# EAGLE design PCB-BI16-3x5+1 (EAGLE 6.5.0)

## Sheet 1 of 2
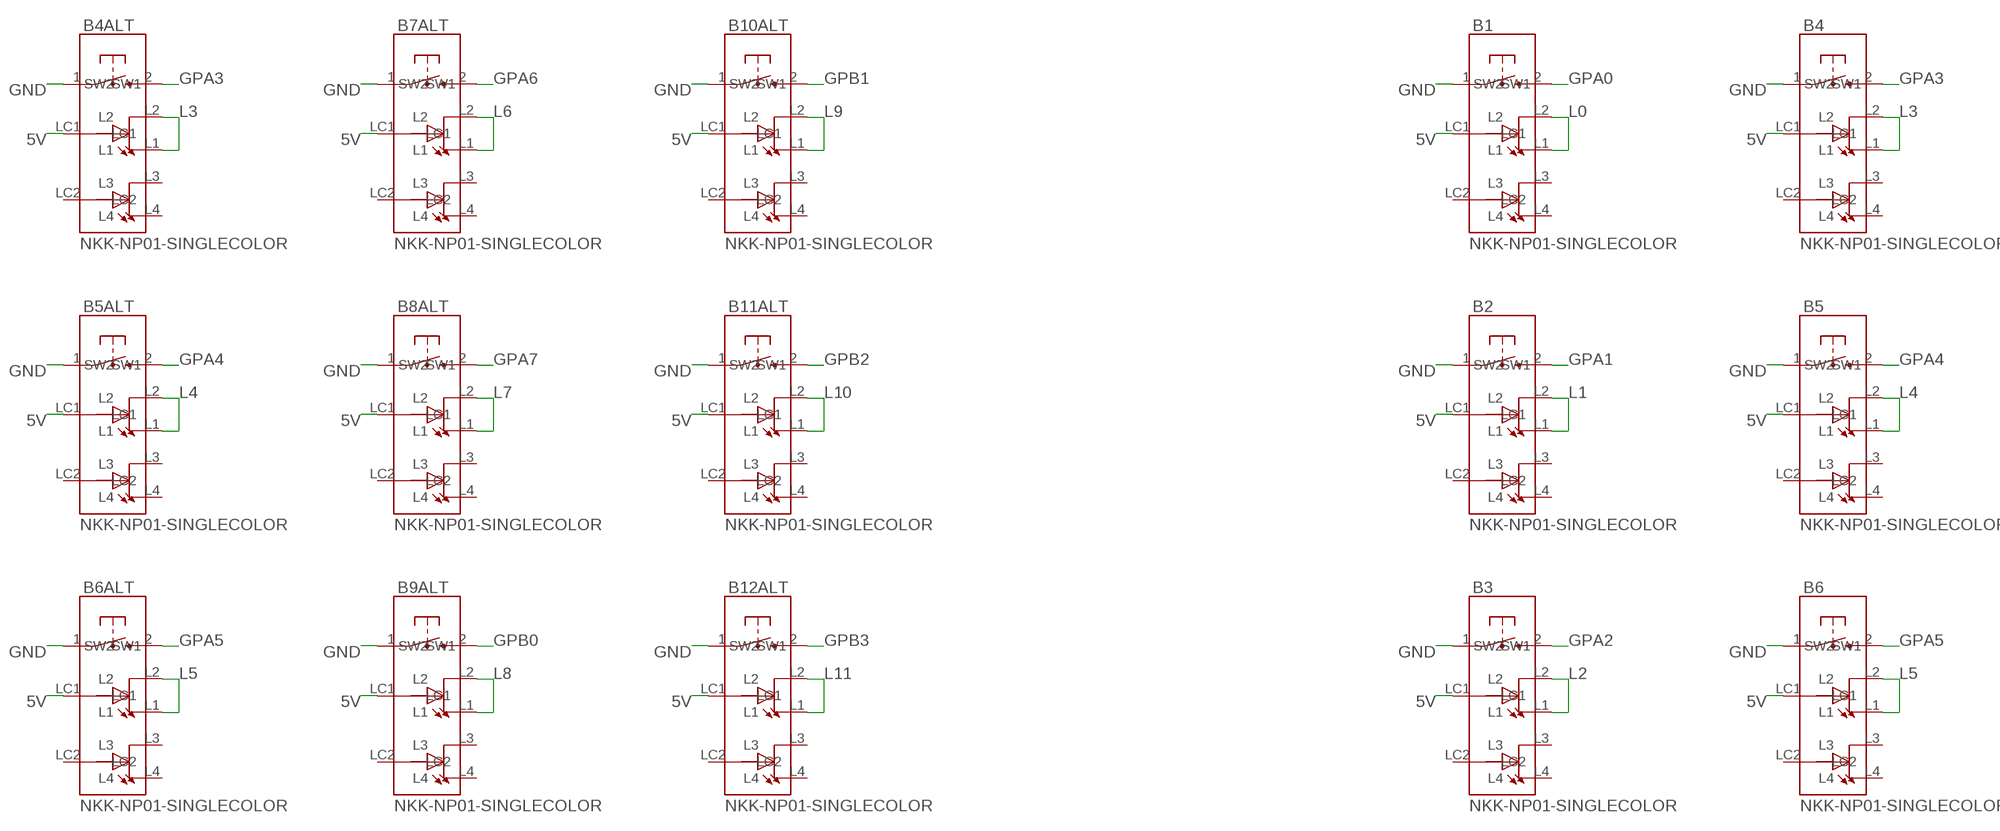
[diagram p0: schematic, sheet 1, part 1 of 2]
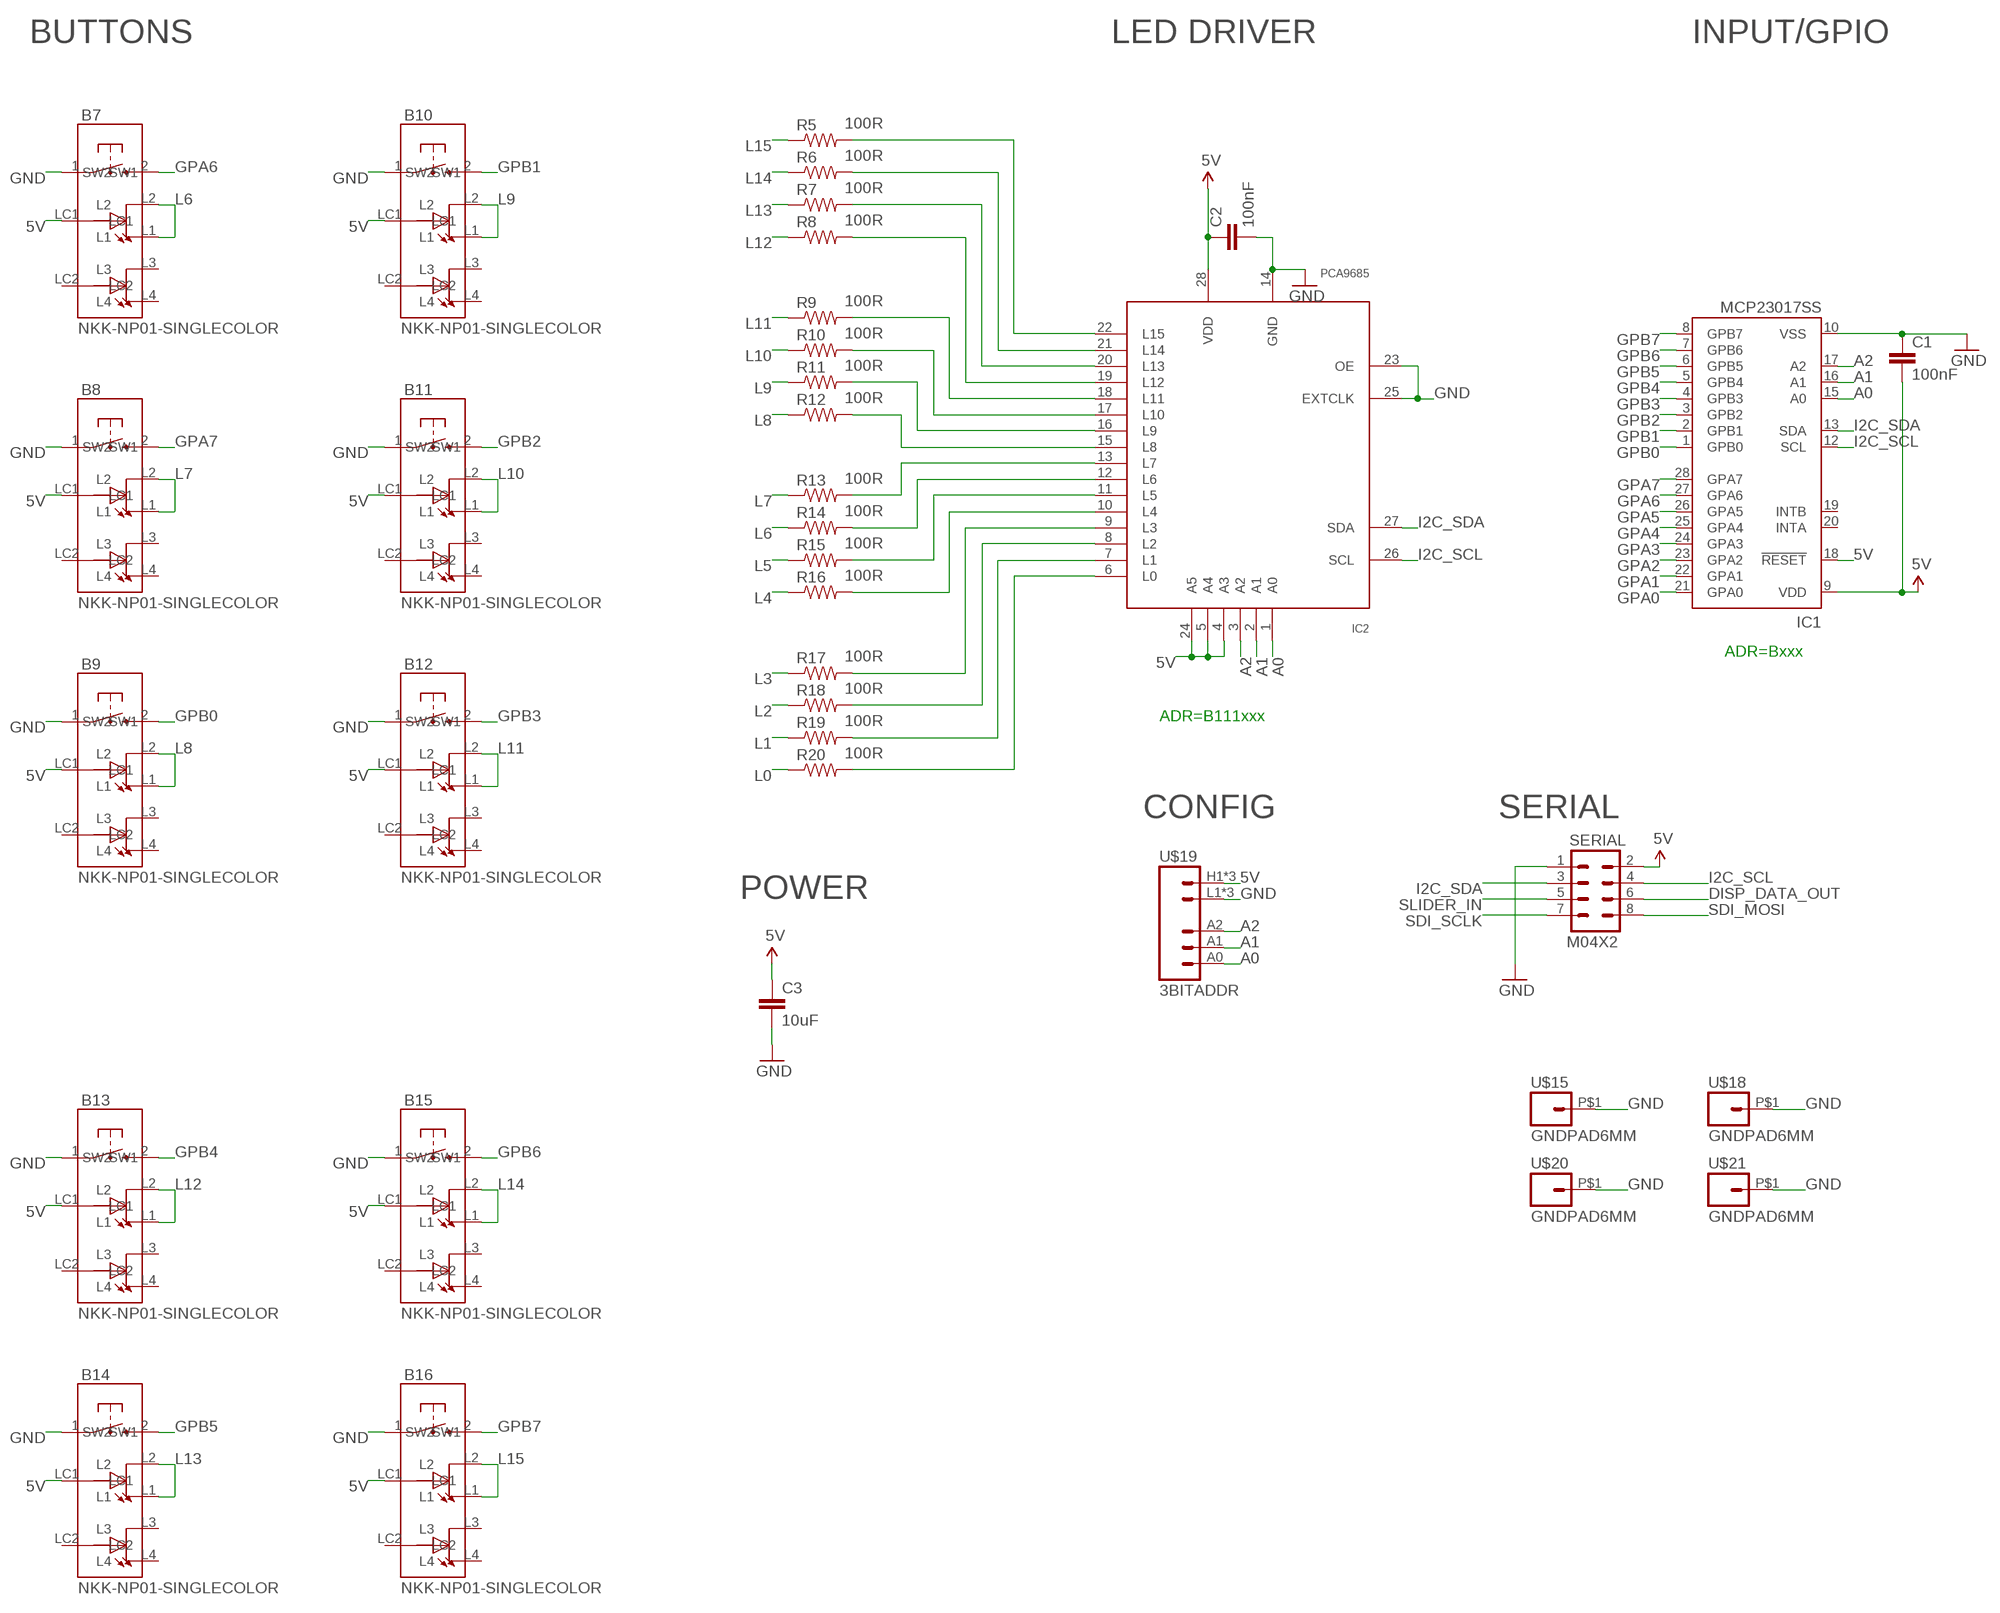
[diagram p1: schematic, sheet 1, part 2 of 2]

### Parts
B1  NKK-NP01-SINGLECOLOR  [NKK-NP01]
B2  NKK-NP01-SINGLECOLOR  [NKK-NP01]
B3  NKK-NP01-SINGLECOLOR  [NKK-NP01]
B4  NKK-NP01-SINGLECOLOR  [NKK-NP01]
B4ALT  NKK-NP01-SINGLECOLOR  [NKK-NP01]
B5  NKK-NP01-SINGLECOLOR  [NKK-NP01]
B5ALT  NKK-NP01-SINGLECOLOR  [NKK-NP01]
B6  NKK-NP01-SINGLECOLOR  [NKK-NP01]
B6ALT  NKK-NP01-SINGLECOLOR  [NKK-NP01]
B7  NKK-NP01-SINGLECOLOR  [NKK-NP01]
B7ALT  NKK-NP01-SINGLECOLOR  [NKK-NP01]
B8  NKK-NP01-SINGLECOLOR  [NKK-NP01]
B8ALT  NKK-NP01-SINGLECOLOR  [NKK-NP01]
B9  NKK-NP01-SINGLECOLOR  [NKK-NP01]
B9ALT  NKK-NP01-SINGLECOLOR  [NKK-NP01]
B10  NKK-NP01-SINGLECOLOR  [NKK-NP01]
B10ALT  NKK-NP01-SINGLECOLOR  [NKK-NP01]
B11  NKK-NP01-SINGLECOLOR  [NKK-NP01]
B11ALT  NKK-NP01-SINGLECOLOR  [NKK-NP01]
B12  NKK-NP01-SINGLECOLOR  [NKK-NP01]
B12ALT  NKK-NP01-SINGLECOLOR  [NKK-NP01]
B13  NKK-NP01-SINGLECOLOR  [NKK-NP01]
B14  NKK-NP01-SINGLECOLOR  [NKK-NP01]
B15  NKK-NP01-SINGLECOLOR  [NKK-NP01]
B16  NKK-NP01-SINGLECOLOR  [NKK-NP01]
C1  100nF  CAP0603-CAP  [0603-CAP]
C2  100nF  CAP0603-CAP  [0603-CAP]
C3  10uF  CAP0805  [0805]
IC1  MCP23017SS  [SSOP28]
IC2  PCA9685  [TSSOP28]
R5  100R  RESISTOR0603-RES  [0603-RES]
R6  100R  RESISTOR0603-RES  [0603-RES]
R7  100R  RESISTOR0603-RES  [0603-RES]
R8  100R  RESISTOR0603-RES  [0603-RES]
R9  100R  RESISTOR0603-RES  [0603-RES]
R10  100R  RESISTOR0603-RES  [0603-RES]
R11  100R  RESISTOR0603-RES  [0603-RES]
R12  100R  RESISTOR0603-RES  [0603-RES]
R13  100R  RESISTOR0603-RES  [0603-RES]
R14  100R  RESISTOR0603-RES  [0603-RES]
R15  100R  RESISTOR0603-RES  [0603-RES]
R16  100R  RESISTOR0603-RES  [0603-RES]
R17  100R  RESISTOR0603-RES  [0603-RES]
R18  100R  RESISTOR0603-RES  [0603-RES]
R19  100R  RESISTOR0603-RES  [0603-RES]
R20  100R  RESISTOR0603-RES  [0603-RES]
SERIAL  M04X2  [2X4]
U$15  GNDPAD6MM  [3.2MMPAD6MM]
U$18  GNDPAD6MM  [3.2MMPAD6MM]
U$19  3BITADDR  [3BITADDR]
U$20  GNDPAD6MM  [3.2MMPAD6MM]
U$21  GNDPAD6MM  [3.2MMPAD6MM]

### Nets
5V [Power]: B1.LC1 B2.LC1 B3.LC1 B4.LC1 B4ALT.LC1 B5.LC1 B5ALT.LC1 B6.LC1 B6ALT.LC1 B7.LC1 B7ALT.LC1 B8.LC1 B8ALT.LC1 B9.LC1 B9ALT.LC1 B10.LC1 B10ALT.LC1 B11.LC1 B11ALT.LC1 B12.LC1 B12ALT.LC1 B13.LC1 B14.LC1 B15.LC1 B16.LC1 C1.2 C2.1 C3.1 IC1.9(VDD) IC1.18(!RESET) IC2.4(A3) IC2.5(A4) IC2.24(A5) IC2.28(VDD) SERIAL.2 U$19.H1(VCC) U$19.H2(VCC) U$19.H3(VCC)
A0: IC1.15(A0) IC2.1(A0) U$19.A0
A1: IC1.16(A1) IC2.2(A1) U$19.A1
A2: IC1.17(A2) IC2.3(A2) U$19.A2
DISP_DATA_OUT: SERIAL.6
GND [Power]: B1.1(SW1) B2.1(SW1) B3.1(SW1) B4.1(SW1) B4ALT.1(SW1) B5.1(SW1) B5ALT.1(SW1) B6.1(SW1) B6ALT.1(SW1) B7.1(SW1) B7ALT.1(SW1) B8.1(SW1) B8ALT.1(SW1) B9.1(SW1) B9ALT.1(SW1) B10.1(SW1) B10ALT.1(SW1) B11.1(SW1) B11ALT.1(SW1) B12.1(SW1) B12ALT.1(SW1) B13.1(SW1) B14.1(SW1) B15.1(SW1) B16.1(SW1) C1.1 C2.2 C3.2 IC1.10(VSS) IC2.14(GND) IC2.23(OE) IC2.25(EXTCLK) SERIAL.1 U$15.P$1 U$18.P$1 U$19.L1(GND) U$19.L2(GND) U$19.L3(GND) U$20.P$1 U$21.P$1
GPA0: B1.2(SW2) IC1.21(GPA0)
GPA1: B2.2(SW2) IC1.22(GPA1)
GPA2: B3.2(SW2) IC1.23(GPA2)
GPA3: B4.2(SW2) B4ALT.2(SW2) IC1.24(GPA3)
GPA4: B5.2(SW2) B5ALT.2(SW2) IC1.25(GPA4)
GPA5: B6.2(SW2) B6ALT.2(SW2) IC1.26(GPA5)
GPA6: B7.2(SW2) B7ALT.2(SW2) IC1.27(GPA6)
GPA7: B8.2(SW2) B8ALT.2(SW2) IC1.28(GPA7)
GPB0 [Power]: B9.2(SW2) B9ALT.2(SW2) IC1.1(GPB0)
GPB1: B10.2(SW2) B10ALT.2(SW2) IC1.2(GPB1)
GPB2: B11.2(SW2) B11ALT.2(SW2) IC1.3(GPB2)
GPB3: B12.2(SW2) B12ALT.2(SW2) IC1.4(GPB3)
GPB4: B13.2(SW2) IC1.5(GPB4)
GPB5: B14.2(SW2) IC1.6(GPB5)
GPB6: B15.2(SW2) IC1.7(GPB6)
GPB7: B16.2(SW2) IC1.8(GPB7)
I2C_SCL: IC1.12(SCL) IC2.26(SCL) SERIAL.4
I2C_SDA: IC1.13(SDA) IC2.27(SDA) SERIAL.3
L0: B1.L1 B1.L2 R20.1
L1: B2.L1 B2.L2 R19.1
L2: B3.L1 B3.L2 R18.1
L3: B4.L1 B4.L2 B4ALT.L1 B4ALT.L2 R17.1
L4: B5.L1 B5.L2 B5ALT.L1 B5ALT.L2 R16.1
L5: B6.L1 B6.L2 B6ALT.L1 B6ALT.L2 R15.1
L6: B7.L1 B7.L2 B7ALT.L1 B7ALT.L2 R14.1
L7: B8.L1 B8.L2 B8ALT.L1 B8ALT.L2 R13.1
L8: B9.L1 B9.L2 B9ALT.L1 B9ALT.L2 R12.1
L9: B10.L1 B10.L2 B10ALT.L1 B10ALT.L2 R11.1
L10: B11.L1 B11.L2 B11ALT.L1 B11ALT.L2 R10.1
L11: B12.L1 B12.L2 B12ALT.L1 B12ALT.L2 R9.1
L12: B13.L1 B13.L2 R8.1
L13: B14.L1 B14.L2 R7.1
L14: B15.L1 B15.L2 R6.1
L15: B16.L1 B16.L2 R5.1
N$4: IC2.13(L7) R13.2
N$5: IC2.12(L6) R14.2
N$7: IC2.11(L5) R15.2
N$9: IC2.10(L4) R16.2
N$10: IC2.9(L3) R17.2
N$11: IC2.8(L2) R18.2
N$12: IC2.7(L1) R19.2
N$19: IC2.6(L0) R20.2
N$20: IC2.15(L8) R12.2
N$21: IC2.16(L9) R11.2
N$22: IC2.17(L10) R10.2
N$23: IC2.18(L11) R9.2
N$24: IC2.19(L12) R8.2
N$25: IC2.20(L13) R7.2
N$26: IC2.21(L14) R6.2
N$27: IC2.22(L15) R5.2
SDI_MOSI: SERIAL.8
SDI_SCLK: SERIAL.7
SLIDER_IN: SERIAL.5
Unconnected: B1.L3 B1.L4 B1.LC2 B2.L3 B2.L4 B2.LC2 B3.L3 B3.L4 B3.LC2 B4.L3 B4.L4 B4.LC2 B4ALT.L3 B4ALT.L4 B4ALT.LC2 B5.L3 B5.L4 B5.LC2 B5ALT.L3 B5ALT.L4 B5ALT.LC2 B6.L3 B6.L4 B6.LC2 B6ALT.L3 B6ALT.L4 B6ALT.LC2 B7.L3 B7.L4 B7.LC2 B7ALT.L3 B7ALT.L4 B7ALT.LC2 B8.L3 B8.L4 B8.LC2 B8ALT.L3 B8ALT.L4 B8ALT.LC2 B9.L3 B9.L4 B9.LC2 B9ALT.L3 B9ALT.L4 B9ALT.LC2 B10.L3 B10.L4 B10.LC2 B10ALT.L3 B10ALT.L4 B10ALT.LC2 B11.L3 B11.L4 B11.LC2 B11ALT.L3 B11ALT.L4 B11ALT.LC2 B12.L3 B12.L4 B12.LC2 B12ALT.L3 B12ALT.L4 B12ALT.LC2 B13.L3 B13.L4 B13.LC2 B14.L3 B14.L4 B14.LC2 B15.L3 B15.L4 B15.LC2 B16.L3 B16.L4 B16.LC2 IC1.19(INTB) IC1.20(INTA)

### Notes on the sheet
- BUTTONS | LED DRIVER | INPUT/GPIO
- ADR=Bxxx
- ADR=B111xxx
- CONFIG | SERIAL
- POWER

## Sheet 2 of 2

## Library data of the parts
B1-B4 B4ALT B5 B5ALT B6 B6ALT B7 B7ALT B8 B8ALT B9 B9ALT B10 B10ALT B11 B11ALT B12 B12ALT B13-B16 = SKAARHOJ:NKK-NP01-SINGLECOLOR
C1-C3 = SparkFun:CAP: Capacitor Standard 0603 ceramic capacitor, and 0.1" leaded capacitor.
IC1 = microchip:MCP23017: http://ww1.microchip.com/downloads/en/DeviceDoc/21952a.pdf Source: http://ww1.microchip.com/downloads/en/DeviceDoc/21952a.pdf; MF: MICROCHIP; MPN: MCP23017-E/SS; OC_FARNELL: 1467674; OC_NEWARK: 31K2960
IC2 = wsmith:PCA9685
R5-R20 = SparkFun:RESISTOR: Resistor Basic schematic elements and footprints for 0603, 1206, and PTH resistors.
SERIAL = SparkFun:M04X2
U$15 U$18 U$20 U$21 = SKAARHOJ:GNDPAD
U$19 = SKAARHOJ:3BITADDR

## Net classes
0 default: width 0.203 mm, drill 0.305 mm, clearance 0.152 mm
1 Power: width 0.406 mm, drill 0.61 mm, clearance 0.203 mm

## Board
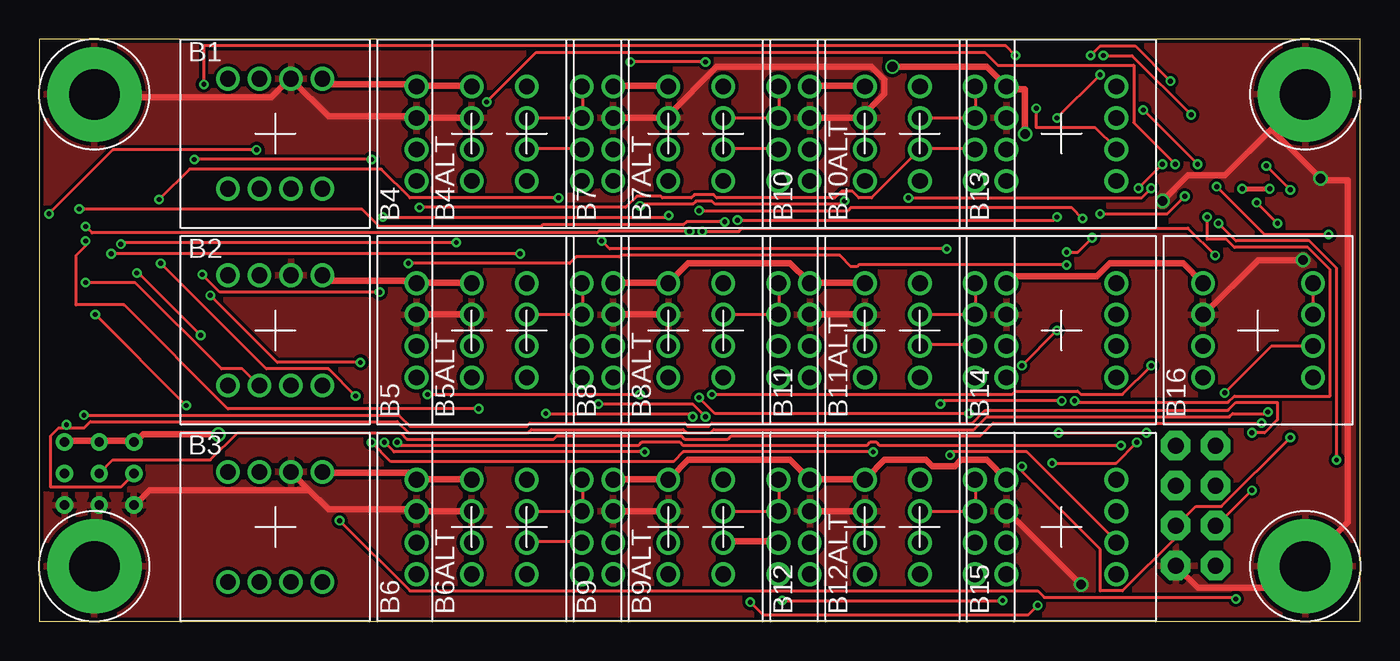
[diagram p2: board, top side]
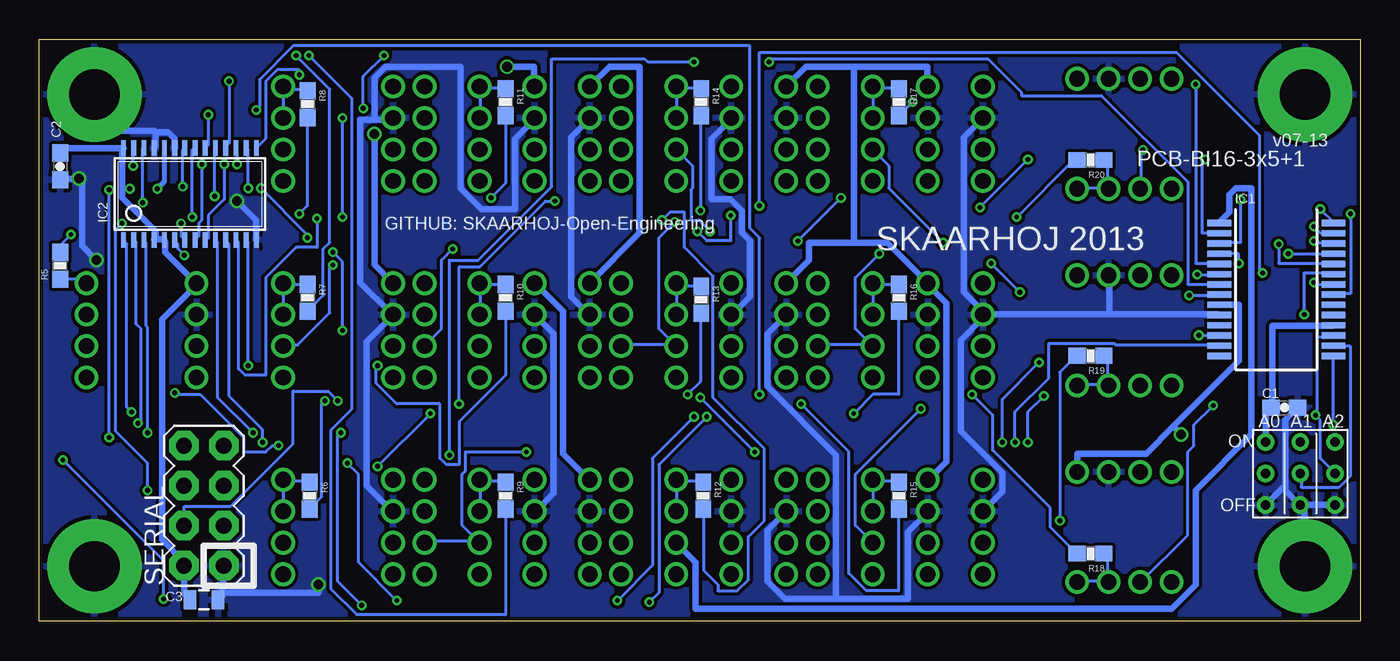
[diagram p3: board, bottom side, seen from below]

Size 84 x 37 mm. Coordinates in mm from the lower left corner, seen from the top.
Outline: 0,0 84,0 84,37 0,37 0,0
Copper layers (1*16): Top 0.035mm / dielectric 1.5mm / Bottom 0.035mm
Design rules "Fusion_eagle_rule_v1.1": minimum track width 6mil, minimum drill 12mil, track to track 6mil, track to pad 6mil, pad to pad 6mil, via to via 6mil, smd to smd 0mil, copper to edge 10mil, drill to drill 10mil, minimum pad ring 10mil, minimum via ring 6mil, stop-mask expansion 2mil, vias tented up to drill 100mil, thermal gap 10mil

### Footprints (pad centres in the part's own frame; a part is rotated, then mirrored left to right if it is on the bottom)
NKK-NP01 = drill 1: 1 1,3.5; 2 -1,-3.5; L1 3,-3.5; L2 1,-3.5; L3 -1,3.5; L4 -3,3.5; LC1 3,3.5; LC2 -3,-3.5
0603-CAP = smd 1.1 x 1: 1 -0.85,0; 2 0.85,0
0805 = smd 0.8 x 1.2: 1 -0.9,0; 2 0.9,0
SSOP28 = smd 0.4 x 1.5: 1 -4.225,-3.625; 2 -3.575,-3.625; 3 -2.925,-3.625; 4 -2.275,-3.625; 5 -1.625,-3.625; 6 -0.975,-3.625; 7 -0.325,-3.625; 8 0.325,-3.625; 9 0.975,-3.625; 10 1.625,-3.625; 11 2.275,-3.625; 12 2.925,-3.625; 13 3.575,-3.625; 14 4.225,-3.625; 15 4.225,3.625; 16 3.575,3.625; 17 2.925,3.625; 18 2.275,3.625; 19 1.625,3.625; 20 0.975,3.625; 21 0.325,3.625; 22 -0.325,3.625; 23 -0.975,3.625; 24 -1.625,3.625; 25 -2.275,3.625; 26 -2.925,3.625; 27 -3.575,3.625; 28 -4.225,3.625
TSSOP28 = smd 0.305 x 0.991: 1 -4.225,-2.918; 2 -3.575,-2.918; 3 -2.925,-2.918; 4 -2.275,-2.918; 5 -1.625,-2.918; 6 -0.975,-2.918; 7 -0.325,-2.918; 8 0.325,-2.918; 9 0.975,-2.918; 10 1.625,-2.918; 11 2.275,-2.918; 12 2.925,-2.918; 13 3.575,-2.918; 14 4.225,-2.918; 15 4.225,2.918; 16 3.575,2.918; 17 2.925,2.918; 18 2.275,2.918; 19 1.625,2.918; 20 0.975,2.918; 21 0.325,2.918; 22 -0.325,2.918; 23 -0.975,2.918; 24 -1.625,2.918; 25 -2.275,2.918; 26 -2.925,2.918; 27 -3.575,2.918; 28 -4.225,2.918
0603-RES = smd 1.1 x 1: 1 -0.85,0; 2 0.85,0
2X4 = drill 1.016 pad 1.88 octagon: 1 -3.81,-1.27; 2 -3.81,1.27; 3 -1.27,-1.27; 4 -1.27,1.27; 5 1.27,-1.27; 6 1.27,1.27; 7 3.81,-1.27; 8 3.81,1.27
3.2MMPAD6MM = drill 3.2 pad 6: P$1 0,0
3BITADDR = drill 0.6: A0 -2.2,0; A1 0,0; A2 2.2,0; H1 -2.2,2; H2 0,2; H3 2.2,2; L1 -2.2,-2; L2 0,-2; L3 2.2,-2

### Placement (x,y rotation side)
B1  15,31 0 top
B2  15,18.5 0 top
B3  15,6 0 top
B4  27.5,31 90 top
B4ALT  31,31 90 top
B5  27.5,18.5 90 top
B5ALT  31,18.5 90 top
B6  27.5,6 90 top
B6ALT  31,6 90 top
B7  40,31 90 top
B7ALT  43.5,31 90 top
B8  40,18.5 90 top
B8ALT  43.5,18.5 90 top
B9  40,6 90 top
B9ALT  43.5,6 90 top
B10  52.5,31 90 top
B10ALT  56,31 90 top
B11  52.5,18.5 90 top
B11ALT  56,18.5 90 top
B12  52.5,6 90 top
B12ALT  56,6 90 top
B13  65,31 90 top
B14  65,18.5 90 top
B15  65,6 90 top
B16  77.5,18.5 90 top
C1  4.83,13.58 180 bottom
C2  82.68,28.92 270 bottom
C3  73.53,1.36 0 bottom
IC1  5.33,21.1 270 bottom
IC2  74.42,27.17 0 bottom
R5  82.68,22.6 90 bottom
R6  66.8,7.99 270 bottom
R7  66.93,20.57 270 bottom
R8  66.93,32.88 270 bottom
R9  54.36,7.99 270 bottom
R10  54.36,20.57 270 bottom
R11  54.36,33.01 270 bottom
R12  41.78,7.99 270 bottom
R13  41.91,20.44 270 bottom
R14  41.91,33.01 270 bottom
R15  29.34,7.99 270 bottom
R16  29.34,20.57 270 bottom
R17  29.34,33.01 270 bottom
R18  17.14,4.31 180 bottom
R19  17.14,16.88 180 bottom
R20  17.14,29.33 180 bottom
SERIAL  73.53,7.36 90 bottom
U$15  3.5,3.5 0 top
U$18  80.5,3.5 0 top
U$19  3.81,9.39 0 bottom
U$20  3.5,33.5 0 top
U$21  80.5,33.5 0 top

### Tracks (layer width: path | path; a pad name or v marks a point on that pad's centre or on a via)
5V  (via drill 0.3, 0.61)
  Top 0.305: v76.5,27.5 v78.25,27.5
  Top 0.406: B14.LC1 61.57,21.54 61.98,21.95 67.26,21.95 68.07,22.76 72.75,22.76 73.97,21.54 B16.LC1 | U$19.H3 1.63,11.48 3.76,11.48 U$19.H2 3.96,11.48 5.99,11.48 U$19.H1 6.2,11.48 6.6,11.89 v11.38,11.89 | B6ALT.LC1 27.43,9.04 24.08,9.04 B6.LC1 23.88,9.14 23.57,9.45 18.09,9.45 B3.LC1 | B9.LC1 36.58,9.04 39.93,9.04 B9ALT.LC1 40.13,9.14 41.25,10.26 47.75,10.26 48.87,9.14 B12.LC1 49.07,9.04 52.43,9.04 B12ALT.LC1 52.63,9.14 53.75,10.26 56.39,10.26 56.79,9.86 58.22,9.86 58.62,10.26 60.25,10.26 61.47,9.04 B15.LC1 | B7.LC1 36.58,34.04 39.93,34.04 B7ALT.LC1 | B4ALT.LC1 27.43,34.04 24.08,34.04 B4.LC1 23.88,34.14 18.39,34.14 18.09,34.44 B1.LC1 | B10.LC1 49.07,34.04 52.43,34.04 B10ALT.LC1 | v54.25,35.26 60.25,35.26 61.47,34.04 B13.LC1 61.57,33.83 62.69,33.83 v62.69,30.99 | B5ALT.LC1 27.43,21.54 24.08,21.54 B5.LC1 23.88,21.64 18.39,21.64 18.09,21.95 B2.LC1 | B8.LC1 36.58,21.54 39.93,21.54 B8ALT.LC1 40.13,21.64 41.25,22.76 47.75,22.76 48.87,21.64 B11.LC1 49.07,21.54 52.43,21.54 B11ALT.LC1
  Bottom 0.305: IC2.24 76.05,27.95 v76.5,27.5 | v78.25,27.5 78.74,27.5
  Bottom 0.406: C3.1 74.47,1.42 74.78,1.73 74.78,3.45 SERIAL.2 74.78,3.76 76.2,5.18 76.2,19.2 74.07,21.34 B16.LC1 74.07,21.54 76,23.47 76,24.08 IC2.5 76.1,24.28 76.61,24.28 IC2.4 76.61,24.49 76.61,24.79 78.74,26.92 78.74,27.5 78.74,29.87 IC2.28 78.74,30.07 82.6,30.07 82.6,29.87 C2.1 | U$19.H1 5.99,11.48 5.99,13.21 5.69,13.51 C1.2 5.59,13.72 5.59,18.8 1.73,18.8 IC1.18 | 11.89,12.39 13.61,10.67 17.98,10.67 17.98,9.55 B3.LC1 | 11.89,12.39 7.72,16.56 7.72,20.12 8.94,20.12 IC1.9 | 11.89,12.39 v11.38,11.89 | 32.21,35.26 27.53,35.26 27.53,34.04 B4ALT.LC1 | 32.21,35.26 35.26,35.26 36.47,34.04 B7.LC1 | v54.25,35.26 52.53,35.26 52.53,34.04 B10ALT.LC1 | 32.21,24.08 35.05,24.08 35.05,22.96 36.47,21.54 B8.LC1 | 32.21,24.08 30.07,24.08 27.53,21.54 B5ALT.LC1 27.43,21.34 26.31,20.22 26.31,10.16 27.43,9.04 B6ALT.LC1 | B10.LC1 48.97,34.04 47.75,35.26 45.82,35.26 45.82,24.69 48.97,21.54 B11.LC1 | 32.21,24.08 32.21,35.26 | B12.LC1 49.07,9.04 50.7,10.67 50.7,19.71 52.43,21.44 B11ALT.LC1 | v62.69,30.99 62.69,22.66 61.57,21.54 B14.LC1
A0  (via drill 0.3)
  Top 0.203: v78.13,13.31 78.03,13.21 75.89,13.21 75.69,13.01 60.25,13.01 59.44,12.19 42.88,12.19 42.67,11.99 41.15,11.99 40.95,12.19 31.29,12.19 31.09,11.99 23.47,11.99 22.76,12.7 3.25,12.7 2.85,12.29 1.73,12.29 | 1.73,12.29 1.22,12.29 0.71,11.79 0.71,8.53 5.18,8.53 5.99,9.35 U$19.A0 | 1.73,12.29 v1.73,12.5
  Bottom 0.203: v78.13,13.31 78.44,13.61 78.44,23.98 78.64,24.18 IC2.1 | v1.73,12.5 1.73,16.87 IC1.15
A1  (via drill 0.3)
  Top 0.203: v77.72,12.6 60.66,12.6 59.84,11.79 43.99,11.79 43.79,11.58 41.05,11.58 40.84,11.79 32.92,11.79 32.72,11.58 23.37,11.58 22.96,11.99 12.6,11.99 10.87,10.26 4.67,10.26 3.86,9.45 U$19.A1
  Bottom 0.203: v77.72,12.6 77.52,12.8 77.52,18.59 77.83,18.9 77.83,24.08 77.93,24.18 IC2.2 | IC1.16 1.63,17.48 0.61,17.48 0.61,9.25 1.32,8.53 3.76,8.53 3.76,9.35 U$19.A1
A2  (via drill 0.3)
  Top 0.203: v77.11,11.99 77.93,11.99 78.74,12.8 78.74,13.92 76.1,13.92 75.59,13.41 60.15,13.41 59.33,12.6 42.77,12.6 42.57,12.39 41.25,12.39 41.05,12.6 31.19,12.6 30.99,12.39 23.57,12.39 22.86,13.11 v2.85,13.11
  Bottom 0.203: v77.11,11.99 77.11,18.69 77.22,18.8 77.22,24.08 77.32,24.18 IC2.3 | U$19.A2 1.63,9.45 2.54,10.36 2.54,12.8 v2.85,13.11 2.74,13.11 2.74,18.09 1.73,18.09 IC1.17
GND  (via drill 0.61)
  Top 0.406: SERIAL.1 72.34,3.45 73.66,2.13 79.15,2.13 80.47,3.45 U$18.P$1 80.57,3.66 83.21,6.3 83.21,28.04 81.58,28.04 v81.48,28.14 78.33,31.29 | v71.42,26.72 73.05,28.35 75.39,28.35 78.33,31.29 | 78.33,31.29 80.47,33.43 U$21.P$1 | v80.37,22.96 77.52,22.96 74.07,19.51 B16.1 | B5.1 24.08,19.51 27.43,19.51 B5ALT.1 | B4ALT.1 27.43,32 24.08,32 B4.1 23.88,32.11 18.39,32.11 16.05,34.44 B1.1 15.85,34.44 14.73,33.33 3.66,33.33 3.56,33.43 U$20.P$1 | B10.1 49.07,32 52.43,32 B10ALT.1 52.43,32.21 53.75,33.53 53.75,34.44 52.93,35.26 43.08,35.26 40.03,32.21 39.93,32.21 B7ALT.1 39.93,32 36.58,32 B7.1 | B12.1 49.07,7.01 52.43,7.01 B12ALT.1 | B11.1 49.07,19.51 52.43,19.51 B11ALT.1 | B8.1 36.58,19.51 39.93,19.51 B8ALT.1 | B9.1 36.58,7.01 39.93,7.01 B9ALT.1 | B6ALT.1 27.43,7.01 24.08,7.01 B6.1 23.88,7.11 18.39,7.11 17.07,8.43 | 17.07,8.43 16.05,9.45 B3.1 | U$19.L1 6.1,7.42 7.01,8.33 16.97,8.33 17.07,8.43 | v66.24,2.34 61.67,6.91 61.57,6.91 B15.1
  Bottom 0.406: SERIAL.1 72.34,3.45 72.34,1.63 72.54,1.42 C3.2 72.24,1.83 66.24,1.83 v66.24,2.34 | 76.61,31.09 75.79,31.09 75.39,30.68 75.39,30.18 IC2.23 | 76.61,31.09 76.61,30.18 IC2.25 | v71.42,26.72 70.21,25.5 70.21,24.28 IC2.14 | C2.2 82.6,28.14 v81.48,28.14 81.28,27.94 81.28,23.88 v80.37,22.96 | 76.61,31.09 76.71,31.19 80.47,31.19 80.47,33.43 U$21.P$1 | 15.95,19.51 9.04,19.51 IC1.10 | 15.95,19.51 15.95,21.95 B2.1 | 15.95,19.51 23.98,19.51 B5.1 | B5.1 23.98,19.71 25.2,20.93 25.2,30.79 24.08,31.9 B4.1 | B15.1 61.57,7.01 63.2,8.64 63.2,17.78 61.57,19.41 B14.1 61.67,19.61 63.6,21.54 63.6,31.9 62.69,31.9 | 62.69,31.9 61.57,31.9 B13.1 | B12ALT.1 52.43,7.01 51.31,8.13 51.31,18.29 52.43,19.41 B11ALT.1 | B10.1 49.07,31.9 50.19,30.79 50.19,20.62 49.07,19.51 B11.1 | 62.69,31.9 62.69,34.54 61.98,35.26 57.2,35.26 57.2,27.53 55.88,26.21 53.75,26.21 53.75,30.68 52.53,31.9 B10ALT.1 | 4.78,8.53 4.78,8.33 3.86,7.42 U$19.L2 | 4.78,8.53 4.78,12.8 4.06,13.51 C1.1 | U$19.L3 1.63,7.42 3.66,7.42 U$19.L2 | U$19.L1 5.99,7.42 4.88,8.53 4.78,8.53 | U$19.L2 3.66,7.21 3.56,7.11 3.56,3.56 U$15.P$1 | B8ALT.1 39.93,19.51 38.81,20.62 38.81,24.18 39.32,24.69 39.32,26.11 40.03,26.82 41.25,26.82 41.25,30.68 40.03,31.9 B7ALT.1 | 33.33,1.42 28.75,1.42 28.75,5.69 27.53,6.91 B6ALT.1 | 33.33,1.42 36.58,1.42 37.69,2.54 37.69,5.79 36.58,6.91 B9.1 | 33.33,1.42 33.33,10.57 37.69,14.94 37.69,18.29 36.58,19.41 B8.1 | B5.1 23.98,19.3 25.4,17.88 25.4,12.09 22.76,9.45 22.76,8.23 23.98,7.01 B6.1
  pour Top: 0,0 84,0 84,37.5 0,37.5
  pour Bottom: 0,0 84,0 84,37 0,37
GPA0  (via drill 0.3)
  Top 0.203: v0.61,25.91 4.67,29.97 v13.82,29.97
  Bottom 0.203: v0.61,25.91 0.61,20.83 1.63,20.83 IC1.21 | v13.82,29.97 13.92,29.87 13.92,27.53 B1.2
GPA1  (via drill 0.3)
  Top 0.203: v2.95,21.54 6.1,21.54 11.58,16.05 12.9,16.05 13.92,15.04 B2.2
  Bottom 0.203: v2.95,21.54 2.95,21.44 1.73,21.44 IC1.22
GPA2  (via drill 0.3)
  Top 0.203: v9.35,13.72 v3.56,19.51
  Bottom 0.203: v3.56,19.51 3.56,22.15 1.73,22.15 IC1.23 | v9.35,13.72 10.57,12.5 10.57,11.18 10.97,10.77 10.97,5.49 13.92,2.54 B3.2
GPA3  (via drill 0.3)
  Top 0.203: v5.18,23.98 5.28,24.08 v26.52,24.08 | B4ALT.2 34.44,30.07 31.09,30.07 B4.2
  Bottom 0.203: v5.18,23.98 5.18,22.76 1.73,22.76 IC1.24 | v26.52,24.08 29.97,27.53 29.97,28.96 30.99,29.97 B4.2
GPA4  (via drill 0.3)
  Top 0.203: v30.58,23.37 v4.57,23.37
  Bottom 0.203: v4.57,23.37 1.73,23.37 IC1.25 | v30.58,23.37 32.11,21.84 32.11,18.59 31.09,17.58 B5.2 31.19,17.58 34.44,17.58 B5ALT.2
GPA5  (via drill 0.3)
  Top 0.203: v2.95,24.18 2.95,23.88 2.34,23.27 2.34,20.12 5.38,20.12 11.99,13.51 v27.94,13.51 | B6ALT.2 34.44,5.08 31.09,5.08 B6.2
  Bottom 0.203: v2.95,24.18 2.95,24.08 1.73,24.08 IC1.26 | v27.94,13.51 32.11,9.35 32.11,6.1 31.09,5.08 B6.2
GPA6  (via drill 0.3)
  Top 0.203: v2.95,25.09 3.35,24.69 35.46,24.69 35.56,24.79 v41.35,24.79 | B7ALT.2 46.94,30.07 43.59,30.07 B7.2
  Bottom 0.203: v2.95,25.09 2.54,24.69 1.73,24.69 IC1.27 | v41.35,24.79 42.06,25.5 42.57,25.5 42.57,27.43 42.47,27.53 42.47,28.96 43.48,29.97 B7.2
GPA7  (via drill 0.3)
  Top 0.203: v2.54,26.21 20.52,26.21 21.64,25.09 31.9,25.09 32,25.2 40.95,25.2 41.15,25.4 v43.59,25.4
  Bottom 0.203: v2.54,26.21 1.73,25.4 IC1.28 | v43.59,25.4 44.6,24.38 44.6,18.59 43.59,17.58 B8.2 43.69,17.58 46.94,17.58 B8ALT.2
GPB0
  Top 0.406: B9ALT.2 46.94,5.08 43.59,5.08 B9.2
  Bottom 0.406: IC1.1 8.94,25.4 8.33,26.01 8.33,27.13 7.92,27.53 6.91,27.53 6.91,11.89 10.46,8.33 10.46,2.34 11.99,0.81 42.27,0.81 42.27,3.76 43.48,4.98 B9.2
GPB1  (via drill 0.3)
  Top 0.203: v21.13,29.36 v9.86,29.36 | v24.18,26.31 37.29,26.31 38,27.03 39.52,27.03 39.62,26.92 41.45,26.92 41.66,27.13 42.88,27.13 43.08,26.92 50.6,26.92 51,27.33 51.71,27.33 52.12,26.92 52.93,26.92 55.98,29.97 B10.2 56.08,30.07 59.44,30.07 B10ALT.2
  Bottom 0.203: v9.86,29.36 10.06,29.16 10.06,24.69 9.04,24.69 IC1.2 | v24.18,26.31 v21.13,29.36
GPB2  (via drill 0.3)
  Top 0.203: v7.62,26.82 9.55,28.75 21.74,28.75 23.57,26.92 v33.02,26.92 | v35.76,24.18 36.27,23.67 v57.71,23.67 | B11.2 56.08,17.58 59.44,17.58 B11ALT.2
  Bottom 0.203: v7.62,26.82 7.62,24.08 8.94,24.08 IC1.3 | v35.76,24.18 v33.02,26.92 | v57.71,23.67 58.42,22.96 58.42,18.59 59.44,17.58 B11ALT.2
GPB3  (via drill 0.3)
  Top 0.203: v7.72,22.76 14.43,16.05 18.39,16.05 v20.12,14.33 | v21.13,11.38 22.35,10.16 40.34,10.16 40.95,10.77 v53.03,10.77
  Bottom 0.203: v7.72,22.76 7.72,23.37 8.94,23.37 IC1.4 | v20.12,14.33 21.13,13.31 v21.13,11.38 | v53.03,10.77 56.9,10.77 56.9,9.55 57.1,9.35 57.1,6.1 56.08,5.08 B12.2 56.19,5.08 59.44,5.08 B12ALT.2
GPB4  (via drill 0.3)
  Top 0.203: v10.46,34.14 10.46,36.58 61.47,36.58 v62.08,35.97 | v63.4,32.61 63.4,31.39 67.16,31.39 68.48,30.07 B13.2
  Bottom 0.203: v10.46,34.14 10.46,22.76 9.04,22.76 IC1.5 | v62.08,35.97 63.4,34.65 v63.4,32.61
GPB5  (via drill 0.3)
  Top 0.203: v10.36,22.05 11.48,20.93 v21.64,20.93 | v23.47,22.76 33.73,22.76 34.14,23.16 36.88,23.16 36.98,23.27 50.9,23.27 51.61,22.55 52.02,22.55 52.12,22.66 v65.33,22.66
  Bottom 0.203: v10.36,22.05 9.04,22.05 IC1.6 | v23.47,22.76 v21.64,20.93 | v65.33,22.66 65.53,22.45 65.53,19.61 67.56,17.58 68.48,17.58 B14.2
GPB6  (via drill 0.3)
  Top 0.203: v42.37,35.56 v37.59,35.56 | v57.91,10.57 58.12,10.77 62.79,10.77 68.48,5.08 B15.2
  Bottom 0.203: v37.59,35.56 37.59,35.76 23.67,35.76 21.54,33.63 21.54,33.43 16.46,33.43 10.97,27.94 10.97,21.44 9.04,21.44 IC1.7 | v42.37,35.56 45.31,35.56 45.52,35.76 51.41,35.76 51.41,27.64 56.08,22.96 57.91,22.96 v57.91,10.57
GPB7  (via drill 0.3)
  Top 0.203: v10.87,20.73 15.14,16.46 v20.42,16.46 | v22.76,11.38 22.96,11.18 38.1,11.18 38.3,11.38 40.74,11.38 40.95,11.18 52.63,11.18 52.83,11.38 53.24,11.38 53.44,11.18 v68.78,11.18 | v75.39,14.53 78.33,17.48 80.97,17.48 B16.2
  Bottom 0.203: v10.87,20.73 9.04,20.73 IC1.8 | v20.42,16.46 22.76,14.12 v22.76,11.38 | v68.78,11.18 69.19,11.18 69.6,10.77 71.02,10.77 71.02,11.68 73.76,14.43 75.39,14.43 v75.39,14.53
I2C_SCL  (via drill 0.3)
  Top 0.203: v78.74,25.3 v77.42,26.62 | v77.11,8.33 74.88,6.1 SERIAL.4 | v10.26,18.19 6.3,22.15 v6.2,22.15 | v38.2,26.42 38.3,26.52 41.55,26.52 41.76,26.72 42.77,26.72 42.98,26.52 51,26.52 v51.21,26.72 | v57.3,13.82 57.51,14.02 v65.02,14.02
  Bottom 0.203: v77.42,26.62 77.42,30.07 IC2.26 | v78.74,25.3 79.15,24.89 79.15,12.09 77.11,10.06 v77.11,8.33 | v10.26,18.19 9.04,18.19 IC1.12 | v6.2,22.15 6.4,22.35 6.4,30.89 11.68,36.17 38.2,36.17 v38.2,26.42 | v51.21,26.72 51.82,26.72 55.98,22.55 57.3,22.55 v57.3,13.82 | v65.02,14.02 65.63,14.63 67.87,14.63 67.87,11.28 71.83,7.32 74.78,7.32 74.78,6.1 SERIAL.4
I2C_SDA  (via drill 0.3)
  Top 0.203: v79.55,27.43 v78.03,28.96 | v79.55,11.68 75.18,7.32 73.56,7.32 72.34,6.1 SERIAL.3 72.24,5.99 72.24,5.28 68.89,1.93 67.46,1.93 67.46,4.57 62.48,9.55 v62.48,9.86 | v21.95,11.38 22.55,10.77 v38.51,10.77 | v41.96,14.22 42.98,13.21 v59.13,13.21
  Bottom 0.203: v78.03,28.96 78.03,30.07 IC2.27 | v79.55,11.68 v79.55,27.43 | v21.95,11.38 21.95,13.31 19.81,15.44 19.81,17.68 15.65,17.68 15.54,17.58 9.04,17.58 IC1.13 | v41.96,14.22 v38.51,10.77 | v62.48,9.86 v59.13,13.21
L0
  Bottom 0.203: R20.1 16.26,29.26 16.05,29.06 16.05,27.53 B1.L2 16.15,27.53 17.98,27.53 B1.L1
L1
  Bottom 0.203: R19.1 16.26,16.87 16.05,16.66 16.05,15.04 B2.L2 16.15,15.04 17.98,15.04 B2.L1
L2
  Bottom 0.203: R18.1 16.26,4.27 16.05,4.06 16.05,2.54 B3.L2 16.15,2.54 17.98,2.54 B3.L1
L3
  Top 0.203: B4ALT.L1 34.54,33.93 34.54,32 B4ALT.L2 34.44,32 31.09,32 B4.L2
  Bottom 0.203: R17.1 29.36,33.93 30.99,33.93 B4.L1 30.99,33.83 30.99,32 B4.L2
L4
  Top 0.203: B5ALT.L1 34.54,21.44 34.54,19.51 B5ALT.L2 34.44,19.51 31.09,19.51 B5.L2
  Bottom 0.203: R16.1 29.36,21.44 30.99,21.44 B5.L1 30.99,21.34 30.99,19.51 B5.L2
L5
  Top 0.203: B6ALT.L1 34.54,8.94 34.54,7.01 B6ALT.L2 34.44,7.01 31.09,7.01 B6.L2
  Bottom 0.203: R15.1 29.36,8.94 30.99,8.94 B6.L1 30.99,8.84 30.99,7.01 B6.L2
L6
  Top 0.203: B7ALT.L1 47.04,33.93 47.04,32 B7ALT.L2 46.94,32 43.59,32 B7.L2
  Bottom 0.203: R14.1 41.96,33.93 43.48,33.93 B7.L1 43.48,33.83 43.48,32 B7.L2
L7
  Top 0.203: B8ALT.L1 47.04,21.44 47.04,19.51 B8ALT.L2 46.94,19.51 43.59,19.51 B8.L2
  Bottom 0.203: 43.48,21.34 41.96,21.34 R13.1 | 43.48,21.34 43.48,21.44 B8.L1 43.48,21.34 | 43.48,21.34 43.48,19.51 B8.L2
L8
  Top 0.203: B9ALT.L1 47.04,8.94 47.04,7.01 B9ALT.L2 46.94,7.01 43.59,7.01 B9.L2
  Bottom 0.203: R12.1 41.86,8.94 43.48,8.94 B9.L1 43.48,8.84 43.48,7.01 B9.L2
L9
  Top 0.203: B10ALT.L1 59.54,33.93 59.54,32 B10ALT.L2 59.44,32 56.08,32 B10.L2
  Bottom 0.203: R11.1 54.36,33.93 55.98,33.93 B10.L1 55.98,33.83 55.98,32 B10.L2
L10
  Top 0.203: B11ALT.L1 59.54,21.44 59.54,19.51 B11ALT.L2 59.44,19.51 56.08,19.51 B11.L2
  Bottom 0.203: R10.1 54.36,21.44 55.98,21.44 B11.L1 55.98,21.34 55.98,19.51 B11.L2
L11
  Top 0.203: B12ALT.L1 59.54,8.94 59.54,7.01 B12ALT.L2 59.44,7.01 56.08,7.01 B12.L2
  Bottom 0.203: R9.1 54.36,8.94 55.98,8.94 B12.L1 55.98,8.84 55.98,7.01 B12.L2
L12
  Bottom 0.203: 68.48,33.83 66.95,33.83 R8.1 | 68.48,33.83 68.48,33.93 B13.L1 68.48,33.83 | 68.48,33.83 68.48,32 B13.L2
L13
  Bottom 0.203: R7.1 66.95,21.44 68.48,21.44 B14.L1 68.48,21.34 68.48,19.51 B14.L2
L14
  Bottom 0.203: R6.1 66.85,8.94 68.48,8.94 B15.L1 68.48,8.84 68.48,7.01 B15.L2
L15
  Top 0.203: B16.L2 80.97,19.51 80.97,21.44 B16.L1
  Bottom 0.203: R5.1 82.6,21.74 81.08,21.74 81.08,21.54 B16.L1
N$4  (via drill 0.3)
  Top 0.203: v70.71,16.26 68.89,14.43 66.24,14.43 66.04,14.63 62.08,14.63 61.87,14.43 v42.77,14.43
  Bottom 0.203: v70.71,16.26 70.71,24.08 70.81,24.18 IC2.13 | v42.77,14.43 41.96,15.24 41.96,19.51 R13.2
N$5  (via drill 0.3)
  Top 0.203: v66.34,25.6 65.63,26.31 51.61,26.31 51.41,26.11 v41.96,26.11
  Bottom 0.203: v66.34,25.6 66.34,23.77 67.67,23.77 69.6,21.84 69.6,15.65 70.92,15.65 71.32,16.05 71.32,24.08 71.42,24.18 IC2.12 | v41.96,26.11 41.96,32.11 R14.2
N$7  (via drill 0.3)
  Top 0.203: v69.8,11.38 68.48,10.06 v64.41,10.06 | v47.24,1.32 v61.27,1.32 | v42.37,13.01 41.55,13.82 v35.56,13.82
  Bottom 0.203: v69.8,11.38 69.8,12.19 71.93,14.33 71.93,23.98 72.14,24.18 IC2.11 | v64.41,10.06 63.7,9.35 63.7,3.76 v61.27,1.32 | v47.24,1.32 45.01,3.56 45.01,10.36 v42.37,13.01 | v35.56,13.82 32.51,10.77 32.51,3.05 31.39,1.93 29.36,1.93 29.36,7.11 R15.2
N$9  (via drill 0.3)
  Top 0.203: v64.82,11.99 v70.41,11.99 | v63.5,1.02 62.89,0.41 46.02,0.41 v45.21,1.22 | v41.55,13.01 41.35,13.21 v32.21,13.21
  Bottom 0.203: v70.41,11.99 72.64,14.22 72.64,24.08 72.75,24.18 IC2.10 | v64.82,11.99 65.02,11.79 65.02,2.54 v63.5,1.02 | v45.21,1.22 44.6,1.83 44.6,9.96 v41.55,13.01 | v32.21,13.21 30.99,14.43 29.36,14.43 29.36,19.71 R16.2
N$10  (via drill 0.3)
  Top 0.203: v72.24,29.06 69.6,31.7 69.6,35.36 60.96,35.36 60.15,36.17 31.6,36.17 v28.45,33.02
  Bottom 0.203: v72.24,29.06 72.24,26.82 73.25,25.81 73.25,24.38 73.36,24.28 IC2.9 | v28.45,33.02 29.26,32.21 R17.2
N$11  (via drill 0.3)
  Top 0.203: v70.21,32.51 v73.66,29.06 | v24.69,14.43 v38.2,14.43
  Bottom 0.203: v73.66,29.06 73.66,25.5 73.86,25.3 73.86,24.49 74.07,24.28 IC2.8 | v70.21,32.51 70,32.72 70,34.44 67.87,36.58 38.81,36.58 38.81,24.99 38.2,24.38 v38.2,14.43 | v24.69,14.43 23.37,13.11 23.37,10.87 19.71,7.21 19.71,5.99 18.09,4.37 R18.2
N$12  (via drill 0.3)
  Top 0.203: v74.98,25.3 76.1,24.18 80.77,24.18 82.5,22.45 v82.5,10.26 | v76.1,1.42 76,1.52 63.91,1.52 63.5,1.93 23.57,1.93 v19.1,6.4
  Bottom 0.203: v74.98,25.3 74.98,24.49 74.78,24.28 IC2.7 | v82.5,10.26 76.1,3.86 v76.1,1.42 | v19.1,6.4 19.1,15.85 18.09,16.87 R19.2
N$19  (via drill 0.3)
  Top 0.203: v74.78,23.27 73.05,24.99 44.7,24.99 44.5,24.79 v42.16,24.79 | v40.03,25.81 39.93,25.7 v21.84,25.7
  Bottom 0.203: v74.78,23.27 75.18,23.67 75.18,23.98 75.39,24.18 IC2.6 | v42.16,24.79 41.55,24.18 40.03,24.18 v40.03,25.81 | v21.84,25.7 18.29,29.26 18.09,29.26 R20.2
N$20  (via drill 0.3)
  Top 0.203: v64.72,32 v67.46,34.75 | v64.72,25.7 64.52,25.5 v44.4,25.5
  Bottom 0.203: v67.46,34.75 67.46,35.05 68.89,35.05 69.6,34.34 69.6,30.68 70.1,30.18 IC2.15 | v64.72,25.7 v64.72,32 | v44.4,25.5 43.89,26.01 42.98,26.01 42.98,23.77 41.15,21.95 41.15,14.22 37.9,10.97 37.9,6.4 38.91,5.38 38.91,2.64 39.62,1.93 40.84,1.93 40.84,2.34 41.76,3.25 41.76,7.11 R12.2
N$21  (via drill 0.3)
  Top 0.203: v70.71,27.53 70.1,26.92 v55.27,26.92
  Bottom 0.203: v70.71,27.53 70.71,29.97 70.81,30.07 IC2.16 | v55.27,26.92 54.36,27.84 R11.2
N$22  (via drill 0.3)
  Top 0.203: v69.9,27.53 v71.42,29.06 | v66.95,24.38 66.04,23.47 v65.33,23.47 | v62.48,16.26 v64.72,18.49
  Bottom 0.203: v71.42,29.06 71.42,30.07 IC2.17 | v69.9,27.53 66.95,24.59 v66.95,24.38 | v65.33,23.47 64.72,22.86 v64.72,18.49 | v62.48,16.26 62.59,16.15 62.59,15.14 61.27,13.82 58.52,13.82 58.52,10.36 58.12,9.96 57.3,9.96 57.3,12.7 54.36,15.65 R10.2
N$23  (via drill 0.3)
  Top 0.203: v71.93,34.34 69.7,36.58 67.46,36.58 v66.85,35.97
  Bottom 0.203: v71.93,34.34 71.93,30.38 72.14,30.18 IC2.18 | v66.85,35.97 64.11,33.22 64.11,13.51 65.43,12.19 65.43,2.03 63.8,0.41 54.36,0.41 R9.2
N$24  (via drill 0.3)
  Top 0.203: v72.85,27.03 71.73,25.91 v67.46,25.91
  Bottom 0.203: v72.85,27.03 72.85,30.07 IC2.19 | v67.46,25.91 66.95,26.42 66.95,32 R8.2
N$25  (via drill 0.3)
  Top 0.203: v73.25,32.21 69.49,35.97 v67.67,35.97
  Bottom 0.203: v73.25,32.21 73.25,30.28 73.36,30.18 IC2.20 | v67.67,35.97 65.53,33.83 65.53,24.08 65.94,23.67 65.94,20.73 66.85,19.81 R7.2
N$26  (via drill 0.3)
  Top 0.203: v74.27,25.7 74.27,24.28 75.49,24.28 76,23.77 80.67,23.77 82.09,22.35 82.09,14.33 76,14.33 75.59,13.92 65.94,13.92 v65.84,14.02
  Bottom 0.203: v74.27,25.7 74.27,29.97 74.17,30.07 IC2.21 | v65.84,14.02 66.04,13.82 66.04,7.92 66.75,7.21 R6.2
N$27  (via drill 0.3)
  Top 0.203: v74.88,27.64 77.93,24.59 v81.99,24.59
  Bottom 0.203: v74.88,27.64 74.88,29.97 74.78,30.07 IC2.22 | v81.99,24.59 82.6,23.98 82.6,23.47 R5.2

### Text on the board
_bsilk: v07-13 | PCB-BI16-3x5+1 | GITHUB: SKAARHOJ-Open-Engineering | SKAARHOJ 2013